# EAGLE design 2020_Circuit_Example_ArduinoUno_Version_Mario (EAGLE 9.5.2)
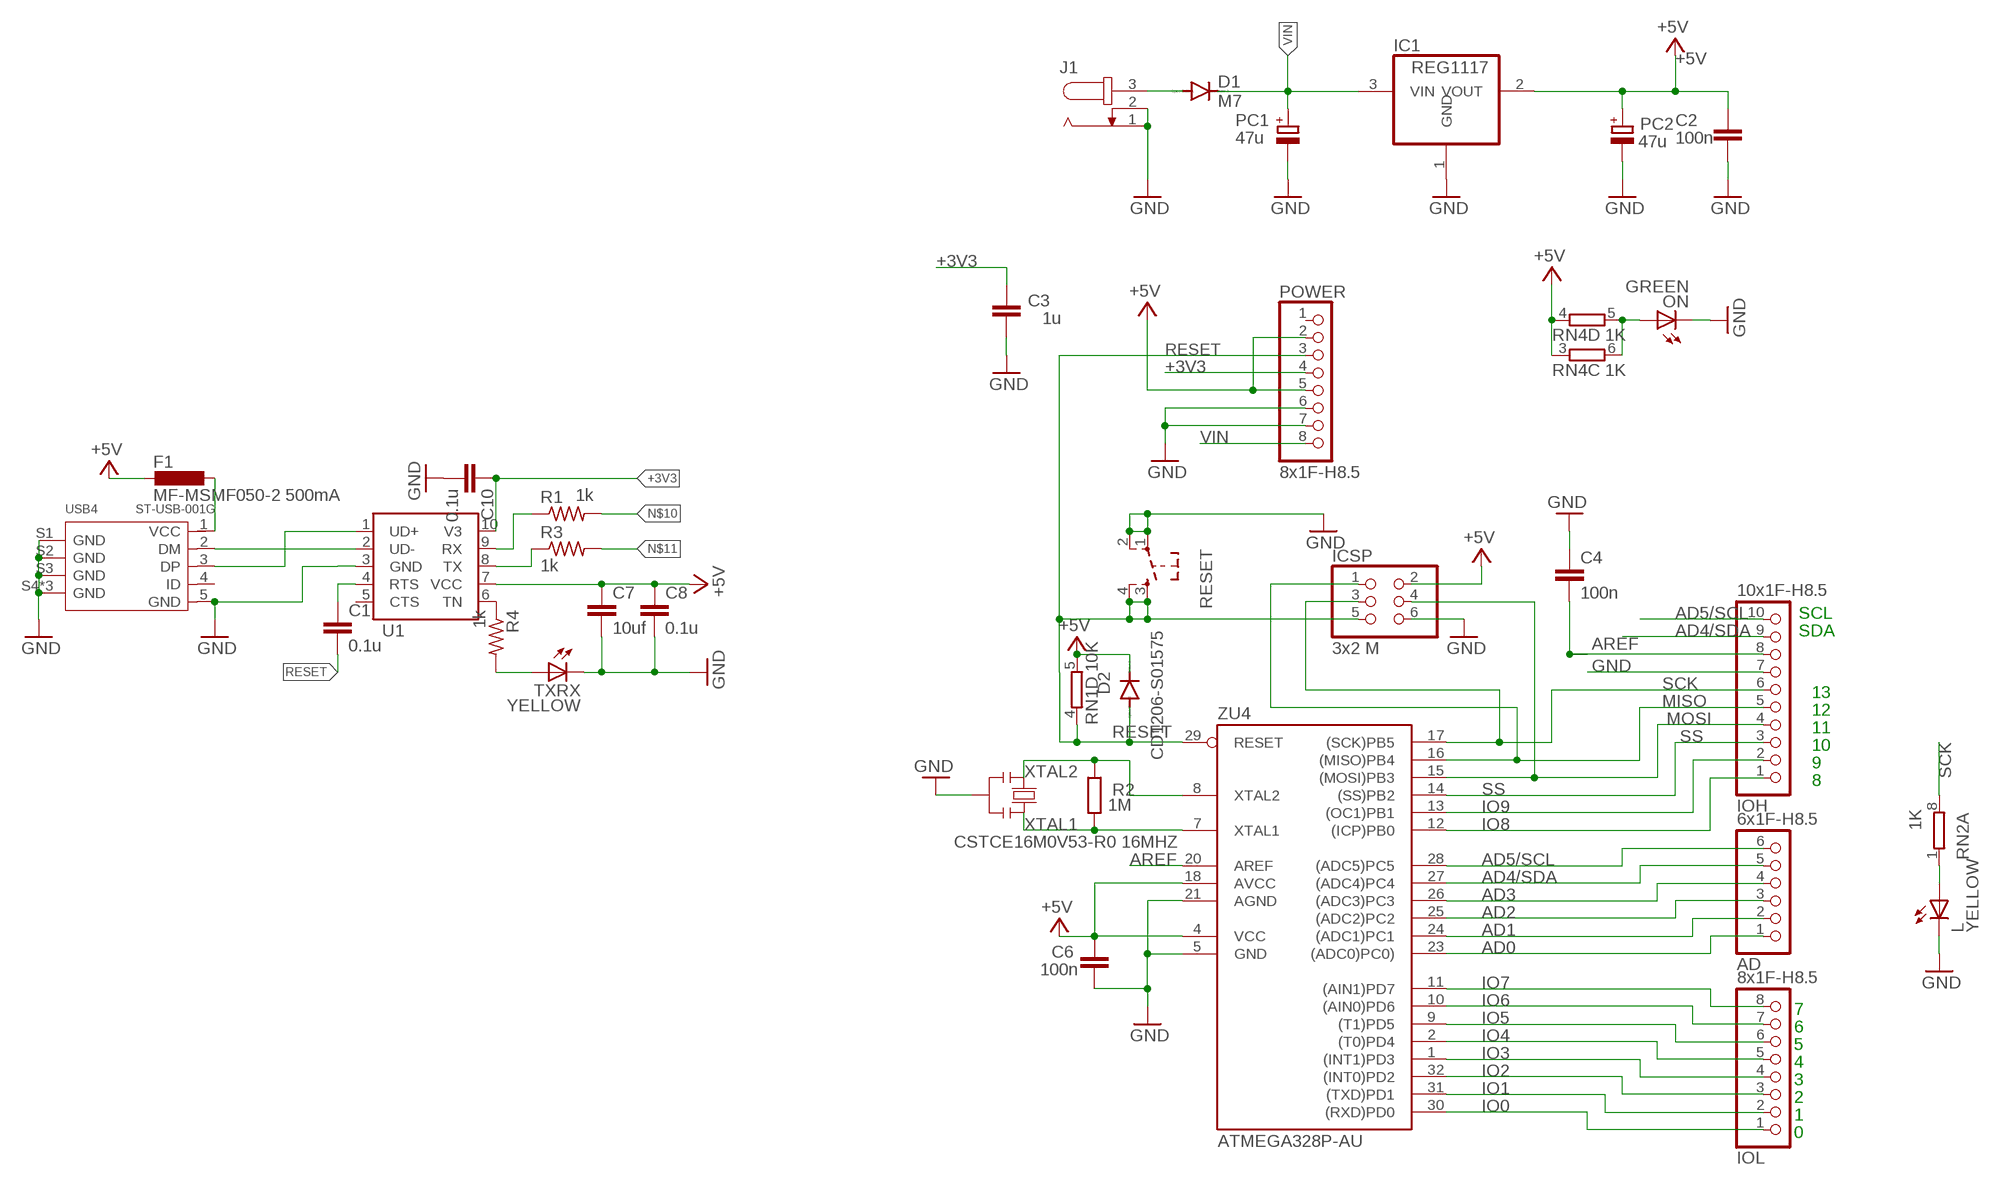
[diagram p0: schematic, sheet 1]

## Parts
AD  6x1F-H8.5  PINHD-1X6  [1X06]
C1  0.1u  C-EUC0805  [C0805]
C2  100n  C-EU0603-RND  [C0603-ROUND]
C3  1u  C-EU0603-RND  [C0603-ROUND]
C4  100n  C-EUC0805  [C0805]
C6  100n  C-EU0603-RND  [C0603-ROUND]
C7  10uf  C-EUC0805  [C0805]
C8  0.1u  C-EUC0805  [C0805]
C10  0.1u  C-EUC0805  [C0805]
D1  M7  DIODE-SMB  [SMB]
D2  CD1206-S01575  DIODE-MINIMELF  [MINIMELF]
F1  MF-MSMF050-2 500mA  L-EUL1812  [L1812]
IC1  REG1117  [SOT223]
ICSP  3x2 M  PINHD-2X3  [2X03]
IOH  10x1F-H8.5  PINHD-1X10_ARD  [1X10]
IOL  8x1F-H8.5  PINHD-1X8  [1X08]
J1  JACK-PLUG0  [SPC4077]
L  YELLOW  LEDCHIP-LED0805  [CHIP-LED0805]
ON  GREEN  LEDCHIP-LED0805  [CHIP-LED0805]
PC1  47u  CPOL-EUD  [PANASONIC_D]
PC2  47u  CPOL-EUD  [PANASONIC_D]
POWER  8x1F-H8.5  PINHD-1X8  [1X08]
R1  1k  R-US_M0805  [M0805]
R2  1M  R-EU_R0603  [R0603-ROUND]
R3  1k  R-US_M0805  [M0805]
R4  1k  R-US_M0805  [M0805]
RESET  SW_TACT_4P  [SW_TACT_SMALL]
RN1  10K  4R-NCAY16  [CAY16]
RN2  1K  4R-NCAY16  [CAY16]
RN4  1K  4R-NCAY16  [CAY16]
TXRX  YELLOW  LEDCHIP-LED0805  [CHIP-LED0805]
U1  CH340ESMD  [MSOP10]
USB4  ST-USB-001G  MICRO-USB-SMD-B-WITHOUT-POST-W/P(ST-USB-001G)  [MICRO-USB5+4P-SMD-0.65-B]
Y2  CSTCE16M0V53-R0 16MHZ  RESONATORMU  [RESONATOR]
ZU4  ATMEGA328P-AU  [TQFP32-08]

## Nets
+3V3: C3.2 C10.1 POWER.4 U1.10(V3)
+5V [usbvcc]: C2.2 C6.2 C7.1 C8.1 D2.C F1.2 IC1.2(VOUT) ICSP.2 PC2.+ POWER.2 POWER.5 RN1.5 RN4.3 RN4.4 U1.7(VCC) ZU4.4(VCC) ZU4.18(AVCC)
AD0: AD.1 ZU4.23((ADC0)PC0))
AD1: AD.2 ZU4.24((ADC1)PC1)
AD2: AD.3 ZU4.25((ADC2)PC2)
AD3: AD.4 ZU4.26((ADC3)PC3)
AD4/SDA: AD.5 IOH.9 ZU4.27((ADC4)PC4)
AD5/SCL: AD.6 IOH.10 ZU4.28((ADC5)PC5)
AREF [aref]: C4.2 IOH.8 ZU4.20(AREF)
GND [gnd]: C2.1 C3.1 C4.1 C6.1 C7.2 C8.2 C10.2 IC1.1(GND) ICSP.6 IOH.7 J1.1 J1.2 L.C ON.C PC1.- PC2.- POWER.6 POWER.7 RESET.1 RESET.2 TXRX.C U1.3(GND) USB4.5(GND) USB4.S1(GND) USB4.S2(GND) USB4.S3(GND) USB4.S4(GND) USB4.S5(GND) USB4.S6(GND) Y2.2 ZU4.5(GND) ZU4.21(AGND)
IO0: IOL.1 ZU4.30((RXD)PD0)
IO1: IOL.2 ZU4.31((TXD)PD1)
IO2: IOL.3 ZU4.32((INT0)PD2)
IO3: IOL.4 ZU4.1((INT1)PD3)
IO4: IOL.5 ZU4.2((T0)PD4)
IO5: IOL.6 ZU4.9((T1)PD5)
IO6: IOL.7 ZU4.10((AIN0)PD6)
IO7: IOL.8 ZU4.11((AIN1)PD7)
IO8: IOH.1 ZU4.12((ICP)PB0)
IO9: IOH.2 ZU4.13((OC1)PB1)
MISO: ICSP.1 IOH.5 ZU4.16((MISO)PB4)
MOSI: ICSP.4 IOH.4 ZU4.15((MOSI)PB3)
N$1: L.A RN2.1
N$2: U1.2(UD-) USB4.2(DM)
N$3: ON.A RN4.5 RN4.6
N$4: U1.1(UD+) USB4.3(DP)
N$5: D1.A J1.3
N$6: F1.1 USB4.1(VCC)
N$7: C1.1 U1.4(RTS)
N$8: R1.1 U1.9(RX)
N$9: R3.1 U1.8(TX)
N$10: R1.2
N$11: R3.2
N$12: R4.1 U1.6(TN)
N$36: R4.2 TXRX.A
RESET: C1.2 D2.A ICSP.5 POWER.3 RESET.3 RESET.4 RN1.4 ZU4.29(RESET)
SCK: ICSP.3 IOH.6 RN2.8 ZU4.17((SCK)PB5)
SS: IOH.3 ZU4.14((SS)PB2)
VIN [power]: D1.C IC1.3(VIN) PC1.+ POWER.8
XTAL1: R2.1 Y2.3 ZU4.7(XTAL1)
XTAL2: R2.2 Y2.1 ZU4.8(XTAL2)
Unconnected: POWER.1 RN1.1 RN1.2 RN1.3 RN1.6 RN1.7 RN1.8 RN2.2 RN2.3 RN2.4 RN2.5 RN2.6 RN2.7 RN4.1 RN4.2 RN4.7 RN4.8 U1.5(CTS) USB4.4(ID)

## Notes on the sheet
- SCL
- SDA
- 13
- 12
- 11
- 10
- 9
- 8
- 7
- 6
- 5
- 4
- 3
- 2
- 1
- 0

## Library data of the parts
AD = SmartPrj:PINHD-1X6: PIN HEADER
C1 C4 C7 C8 C10 = rcl:C-EU: CAPACITOR, European symbol
C2 C3 C6 = SmartPrj:C-EU: CAPACITOR, European symbol
D1 D2 = diode:DIODE-: DIODE
F1 = rcl:L-EU: INDUCTOR, European symbol
IC1 = burr-brown:REG1117: 800mA and 1A Low Dropout (LDO) Positive Regulator 1.8V, 2.5V, 2.85V, 3.3V, 5V, and Adj; MPN: REG1117; OC_FARNELL: 1097566; OC_NEWARK: 14P6981
ICSP = SmartPrj:PINHD-2X3: PIN HEADER
IOH = SmartPrj:PINHD-1X10_ARD: PIN HEADER
IOL POWER = SmartPrj:PINHD-1X8: PIN HEADER
J1 = con-jack:JACK-PLUG: DC POWER JACK Power Jack, DC, Right Angle, Through Hole, Rated 5A at 16VDC, PC Terminals Distributor: Farnell (www.Farnell.de) Drawing: 84N1161.pdf / 84N1162.pdf Manufacturer: SPC Technology (www.spctechnology.com) Type: SPC4077 / SPC 4078; OC_FARNELL: unknown; OC_NEWARK: unknown
L ON TXRX = led:LED: LED OSRAM: - CHIPLED LG R971, LG N971, LY N971, LG Q971, LY Q971, LO R971, LY R971 LH N974, LH R974 LS Q976, LO Q976, LY Q976 LO Q996 - Hyper CHIPLED LW Q18S LB Q993, LB Q99A, LB R99A - SideLED LS A670, LO A670, LY A670, LG A670, LP A670 LB A673, LV A673, LT A673, LW A673 LH A674 LY A675 LS A676, LA A676, LO A676, LY A676, LW A676 LS A679, LY A679, LG A679 - Hyper Micro SIDELED® LS Y876, LA Y876, LO Y876, LY Y876 LT Y87S - SmartLED LW L88C, LW L88S LB L89C, LB L89S, LG L890 LS L89K, LO L89K, LY L89K LS L896, LA L896, LO L896, LY L896 - TOPLED LS T670, LO T670, LY T670, LG T670, LP T670 LSG T670, LSP T670, LSY T670, LOP T670, LYG T670 LG T671, LOG T671, LSG T671 LB T673, LV T673, LT T673, LW T673 LH T674 LS T676, LA T676, LO T676, LY T676, LB T676, LH T676, LSB T676, LW T676 LB T67C, LV T67C, LT T67C, LS T67K, LO T67K, LY T67K, LW E67C LS E67B, LA E67B, LO E67B, LY E67B, LB E67C, LV E67C, LT E67C LW T67C LS T679, LY T679, LG T679 LS T770, LO T770, LY T770, LG T770, LP T770 LB T773, LV T773, LT T773, LW T773 LH T774 LS E675, LA E675, LY E675, LS T675 LS T776, LA T776, LO T776, LY T776, LB T776 LHGB T686 LT T68C, LB T68C - Hyper Mini TOPLED® LB M676 - Mini TOPLED Santana® LG M470 LS M47K, LO M47K, LY M47K Source: http://www.osram.convergy.de LUXEON: - LUMILED® LXK2-PW12-R00, LXK2-PW12-S00, LXK2-PW14-U00, LXK2-PW14-V00 LXK2-PM12-R00, LXK2-PM12-S00, LXK2-PM14-U00 LXK2-PE12-Q00, LXK2-PE12-R00, LXK2-PE12-S00, LXK2-PE14-T00, LXK2-PE14-U00 LXK2-PB12-K00, LXK2-PB12-L00, LXK2-PB12-M00, LXK2-PB14-N00, LXK2-PB14-P00, LXK2-PB14-Q00 LXK2-PR12-L00, LXK2-PR12-M00, LXK2-PR14-Q00, LXK2-PR14-R00 LXK2-PD12-Q00, LXK2-PD12-R00, LXK2-PD12-S00 LXK2-PH12-R00, LXK2-PH12-S00 LXK2-PL12-P00, LXK2-PL12-Q00, LXK2-PL12-R00 Source: www.luxeon.com KINGBRIGHT: KA-3528ASYC Source: www.kingbright.com
PC1 PC2 = rcl:CPOL-EU: POLARIZED CAPACITOR, European symbol
R1 R3 R4 = rcl:R-US_: RESISTOR, American symbol
R2 = SmartPrj:R-EU_: RESISTOR, European symbol
RESET = dp_devices:SW_TACT_4P
RN1 RN2 RN4 = resistor-dil:4R-N: Array Chip Resistor Source: RS Component / Phycomp; OC_FARNELL: unknown; OC_NEWARK: unknown
U1 = CH340E:CH340E: WCH.CN/CH340E See DataSheet： wch.cn <http://www.wch.cn/downloads/CH340DS1_PDF.html>
USB4 = OPL_Connector:MICRO-USB-SMD-B-WITHOUT-POST-W/P(ST-USB-001G): 320010000; MPN: ST-USB-001G
Y2 = SmartPrj:RESONATOR
ZU4 = SmartPrj:ATMEGA328P-: MICROCONTROLLER 4 Kbytes FLASH 128 bytes SRAM 256 bytes EEPROM UART 6-channel 10 bit ADC

## Net classes
0 default: width 0.254 mm, clearance 0.254 mm
1 power: width 0.61 mm, drill 0.61 mm, clearance 0.254 mm
2 gnd: width 0.305 mm, drill 0.559 mm, clearance 0.254 mm
3 usbvcc: width 0.508 mm, drill 0.61 mm, clearance 0.254 mm
4 aref: width 0.406 mm, drill 0.61 mm, clearance 0.254 mm

## Board
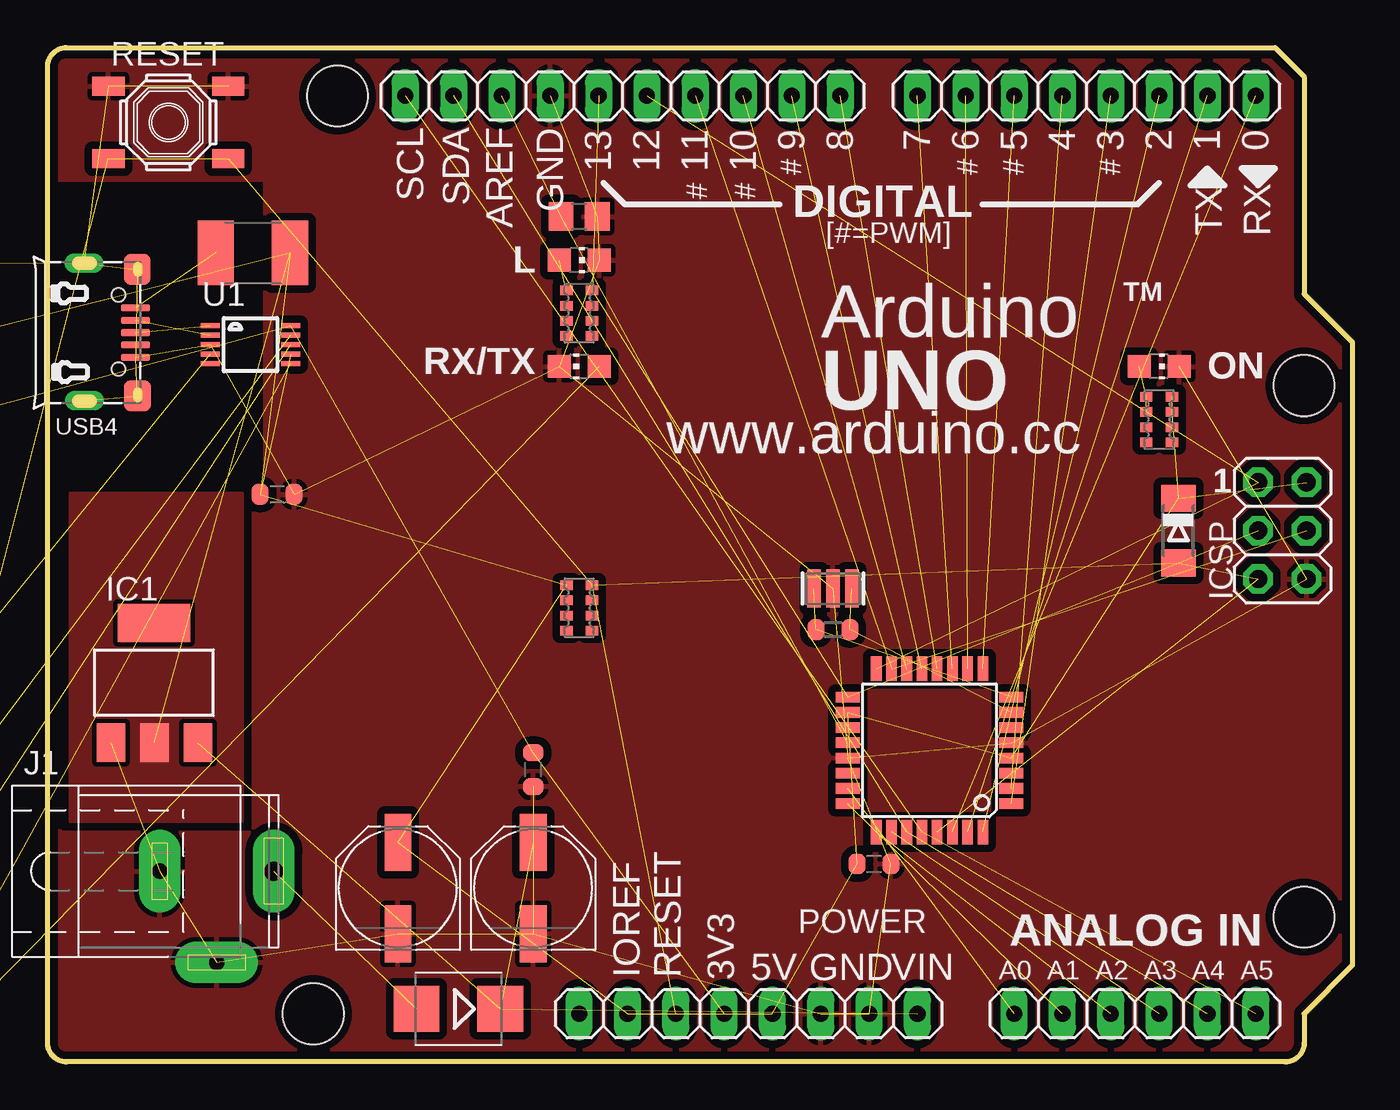
[diagram p1: board, top side]
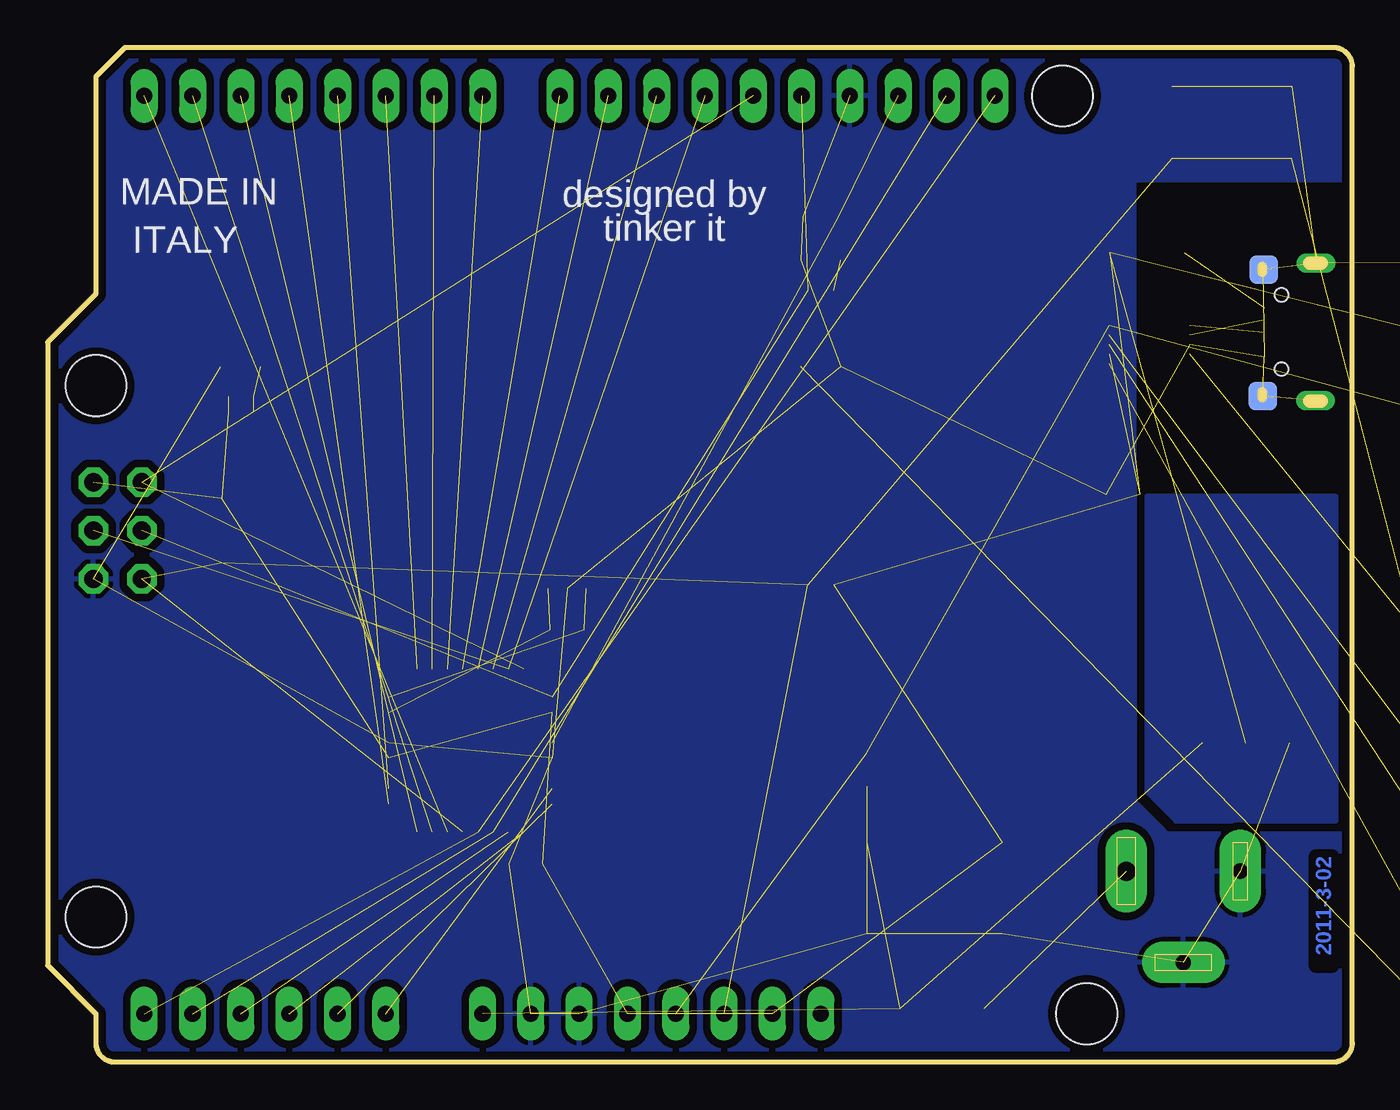
[diagram p2: board, bottom side, seen from below]

Size 68.58 x 53.34 mm. Coordinates in mm from the lower left corner, seen from the top.
Outline: 64.52,53.34 66.04,51.82 66.04,40.39 68.58,37.85 68.58,5.08 66.04,2.54 66.04,1 arc-90 65.04,0 1,0 arc-90 0,1 0,52.34 arc-90 1,53.34 64.52,53.34
Copper layers (1*16): Top 0.035mm / dielectric 1.5mm / Bottom 0.035mm
Design rules "_xircuitos.mx_2L_DRC": minimum track width 6mil, minimum drill 12mil, track to track 6mil, track to pad 6mil, pad to pad 6mil, via to via 6mil, smd to smd 0mil, copper to edge 10mil, drill to drill 12mil, minimum pad ring 10mil, minimum via ring 6mil, stop-mask expansion 2mil, vias tented up to drill 100mil, thermal gap 10mil
Holes 3.2 mm at 66.04,35.56 66.04,7.62 15.24,50.8 13.97,2.54
vRestrict: area 22.9,44.1 to 24.6,49.1; area 25.4,45.5 to 27.1,49.1; area 28.4,45.3 to 29.6,48.8; area 31,45.3 to 32.1,48.8; area 33.5,45.3 to 34.7,48.8; area 36.1,45.3 to 37.2,48.8; area 38.7,47.2 to 39.9,48.8; area 40.3,45.1 to 47.6,46.9; area 60.3,44.2 to 61.7,46.7; area 62.9,44.2 to 64.3,46.7; area 61.3,35.8 to 64.8,37.2; area 0.6,21.8 to 2,30.1; area 5.7,22.6 to 7.4,30.1; area 47.9,10.3 to 48.5,10.8; area 50.4,10.2 to 50.9,11; area 11.3,28.8 to 12.7,31.1; area 44.8,47.5 to 46.1,48.9; area 47.6,47.4 to 48.8,48.9; area 50.2,47.4 to 51.3,48.9; area 52.8,47.4 to 54,48.9; area 55.2,47.4 to 56.4,48.9; area 57.9,47.4 to 59.1,48.9; area 60.5,47.4 to 61.6,48.9; area 63,47.4 to 64.1,48.9; area 41.3,47.2 to 42.4,48.8; area 0.3,12.4 to 9.4,24.5

### Footprints (pad centres in the part's own frame; a part is rotated, then mirrored left to right if it is on the bottom)
1X06 = drill 0.85 pad 1.422 long: 1 -6.35,0; 2 -3.81,0; 3 -1.27,0; 4 1.27,0; 5 3.81,0; 6 6.35,0
C0805 = smd 1.3 x 1.5: 1 -0.95,0; 2 0.95,0
C0603-ROUND = smd 0.898 x 1.1: 1 -0.889,0; 2 0.889,0
SMB = smd 2.4 x 2.4: A 2.2,0; C -2.2,0
MINIMELF = smd 1.4 x 1.8: A 1.7,0; C -1.7,0
L1812 = smd 1.9 x 3.4: 1 -1.95,0; 2 1.95,0
SOT223 = smd 1.499 x 2.007: 1 -2.261,-3.15; 2 0.025,-3.15; 3 2.311,-3.15 | smd 3.81 x 2.007: 4 0,3.15
2X03 = drill 0.95 pad 1.55 octagon: 1 -2.54,-1.27; 2 -2.54,1.27; 3 0,-1.27; 4 0,1.27; 5 2.54,-1.27; 6 2.54,1.27
1X10 = drill 0.85 pad 1.422 long: 1 -11.43,0; 2 -8.89,0; 3 -6.35,0; 4 -3.81,0; 5 -1.27,0; 6 1.27,0; 7 3.81,0; 8 6.35,0; 9 8.89,0; 10 11.43,0
1X08 = drill 0.85 pad 1.422 long: 1 -8.89,0; 2 -6.35,0; 3 -3.81,0; 4 -1.27,0; 5 1.27,0; 6 3.81,0; 7 6.35,0; 8 8.89,0
SPC4077 = drill 0.8 pad 2.184 long: 1 -3,0; 2 0,-4.8 | drill 1 pad 2.184 long: 3 3,0
CHIP-LED0805 = smd 1.2 x 1.2: A 0,-1.05; C 0,1.05
PANASONIC_D = smd 3 x 1.4: + 2.4,0; - -2.4,0
M0805 = smd 1.3 x 1.6: 1 -0.95,0; 2 0.95,0
R0603-ROUND = smd 0.898 x 1.1: 1 -0.889,0; 2 0.889,0
SW_TACT_SMALL = smd 1.7 x 1: 1 -3.15,1.9; 2 3.15,1.9; 3 -3.15,-1.9; 4 3.15,-1.9
CAY16 = smd 0.5 x 0.65: 1 -1.2,-0.675; 2 -0.4,-0.675; 3 0.4,-0.675; 4 1.2,-0.675; 5 1.2,0.675; 6 0.4,0.675; 7 -0.4,0.675; 8 -1.2,0.675
MSOP10 = smd 1 x 0.25: 1 -2.113,1; 2 -2.113,0.5; 3 -2.113,0; 4 -2.113,-0.5; 5 -2.113,-1; 6 2.113,-1; 7 2.113,-0.5; 8 2.113,0; 9 2.113,0.5; 10 2.113,1
MICRO-USB5+4P-SMD-0.65-B = smd 1.524 x 0.381: 1 -2.85,-1.3; 2 -2.85,-0.65; 3 -2.85,0; 4 -2.85,0.65; 5 -2.85,1.3 | smd 1.397 x 1.6: S1 -2.933,-3.32; S6 -2.953,3.33 | drill 0.508 pad 1.016 long: S2 -0.13,-3.655; S5 -0.17,3.585 | smd 1.5 x 1.5 bottom: S3 -2.88,-3.31; S4 -2.94,3.34 | hole 0.7: -1.953,-1.981; -1.953,1.918
RESONATOR = smd 0.7 x 2: 1 -1,0; 2 0,0; 3 1,0
TQFP32-08 = smd 1.27 x 0.559: 1 -4.293,2.8; 2 -4.293,2; 3 -4.293,1.2; 4 -4.293,0.4; 5 -4.293,-0.4; 6 -4.293,-1.2; 7 -4.293,-2; 8 -4.293,-2.8; 17 4.293,-2.8; 18 4.293,-2; 19 4.293,-1.2; 20 4.293,-0.4; 21 4.293,0.4; 22 4.293,1.2; 23 4.293,2; 24 4.293,2.8 | smd 0.559 x 1.27: 9 -2.8,-4.293; 10 -2,-4.293; 11 -1.2,-4.293; 12 -0.4,-4.293; 13 0.4,-4.293; 14 1.2,-4.293; 15 2,-4.293; 16 2.8,-4.293; 25 2.8,4.293; 26 2,4.293; 27 1.2,4.293; 28 0.4,4.293; 29 -0.4,4.293; 30 -1.2,4.293; 31 -2,4.293; 32 -2.8,4.293

### Placement (x,y rotation side)
AD  57.15,2.54 0 top
C1  -5.08,19.3 0 top  (outside the outline)
C2  12.06,29.84 180 top
C3  25.53,15.37 90 top
C4  27.94,44.45 180 top
C6  43.43,10.41 180 top
C7  -4.95,42.04 0 top  (outside the outline)
C8  -4.95,37.85 0 top  (outside the outline)
C10  -4.95,33.66 0 top  (outside the outline)
D1  21.59,2.79 180 top
D2  59.44,27.94 270 top
F1  10.79,42.55 0 top
IC1  5.59,19.94 0 top
ICSP  64.9,27.94 270 top
IOH  30.23,50.8 180 top
IOL  54.61,50.8 180 top
J1  8.89,10.03 0 top
L  27.94,42.16 270 top
ON  58.42,36.58 270 top
PC1  25.53,9.14 90 top
PC2  18.41,9.14 90 top
POWER  36.83,2.54 0 top
R1  -5.08,13.08 0 top  (outside the outline)
R2  41.27,22.73 180 top
R3  -5.08,8.89 0 top  (outside the outline)
R4  -5.08,2.67 0 top  (outside the outline)
RESET  6.35,49.4 0 top
RN1  27.94,23.88 90 top
RN2  27.94,39.37 270 top
RN4  58.42,33.78 90 top
TXRX  27.94,36.58 90 top
U1  10.67,37.72 0 top
USB4  1.78,38.35 180 top
Y2  41.27,24.89 0 top
ZU4  46.35,16.38 180 top

### Tracks (layer width: path | path; a pad name or v marks a point on that pad's centre or on a via)
+3V3  (3 unrouted)
+5V  (16 unrouted)
  pour Bottom (isolate 0.406, no thermals): 0.89,29.72 10.79,29.72 10.79,21.34 10.79,14.22 9.27,12.7 0.89,12.7
  pour Top (no thermals): 1.27,12.7 1.27,29.84 10.16,29.84 10.16,12.7
AD0  (1 unrouted)
AD1  (1 unrouted)
AD2  (1 unrouted)
AD3  (1 unrouted)
AD4/SDA  (2 unrouted)
AD5/SCL  (2 unrouted)
AREF  (2 unrouted)
GND  (31 unrouted)
  pour Bottom (isolate 0.406, rank 2): 0.64,52.7 67.69,52.7 67.94,52.45 67.94,0.64 0.89,0.64 0.64,0.89 0.64,30.1 11.43,30.1 11.43,46.35 0.64,46.35
  pour Top (isolate 0.406, rank 2): 0.64,52.7 67.94,52.7 67.94,0.64 0.64,0.64 0.51,30.48 11.43,30.48 11.43,46.35 0.64,46.35
IO0  (1 unrouted)
IO1  (1 unrouted)
IO2  (1 unrouted)
IO3  (1 unrouted)
IO4  (1 unrouted)
IO5  (1 unrouted)
IO6  (1 unrouted)
IO7  (1 unrouted)
IO8  (1 unrouted)
IO9  (1 unrouted)
MISO  (2 unrouted)
MOSI  (2 unrouted)
N$1  (1 unrouted)
N$2  (1 unrouted)
N$3  (2 unrouted)
N$4  (1 unrouted)
N$5  (1 unrouted)
N$6  (1 unrouted)
N$7  (1 unrouted)
N$8  (1 unrouted)
N$9  (1 unrouted)
N$12  (1 unrouted)
N$36  (1 unrouted)
RESET  (7 unrouted)
SCK  (3 unrouted)
SS  (1 unrouted)
VIN  (3 unrouted)
XTAL1  (2 unrouted)
XTAL2  (2 unrouted)

### Text on the board
Bottom: 2011-3-02
tPlace: 13 | 12 | 11 | 10 | 9 | 8 | 7 | 6 | 5 | 4 | 3 | 2 | 1 | 0
tNames: SCL | SDA | AREF | GND | # | # | # | # | # | # | DIGITAL | [#=PWM] | TX | RX | TM | RX/TX | Arduino | UNO | www.arduino.cc | 1 | ANALOG IN | IOREF | RESET | 3V3 | 5V | GND | VIN | A0 | A1 | A2 | A3 | A4 | A5
bNames: MADE IN | designed by | MADE IN | ITALY | tinker it | ITALY | designed by | tinker it | ATMEGA328
ReferenceLC: L | TX | ON | RX | PC1 | PC2
214bmp: D:/SmartProjects/Snc/a4_bn_logo2.bmp